# EAGLE schematic LEDBatterychargeIndicatorCircuit (EAGLE 9.4.2)
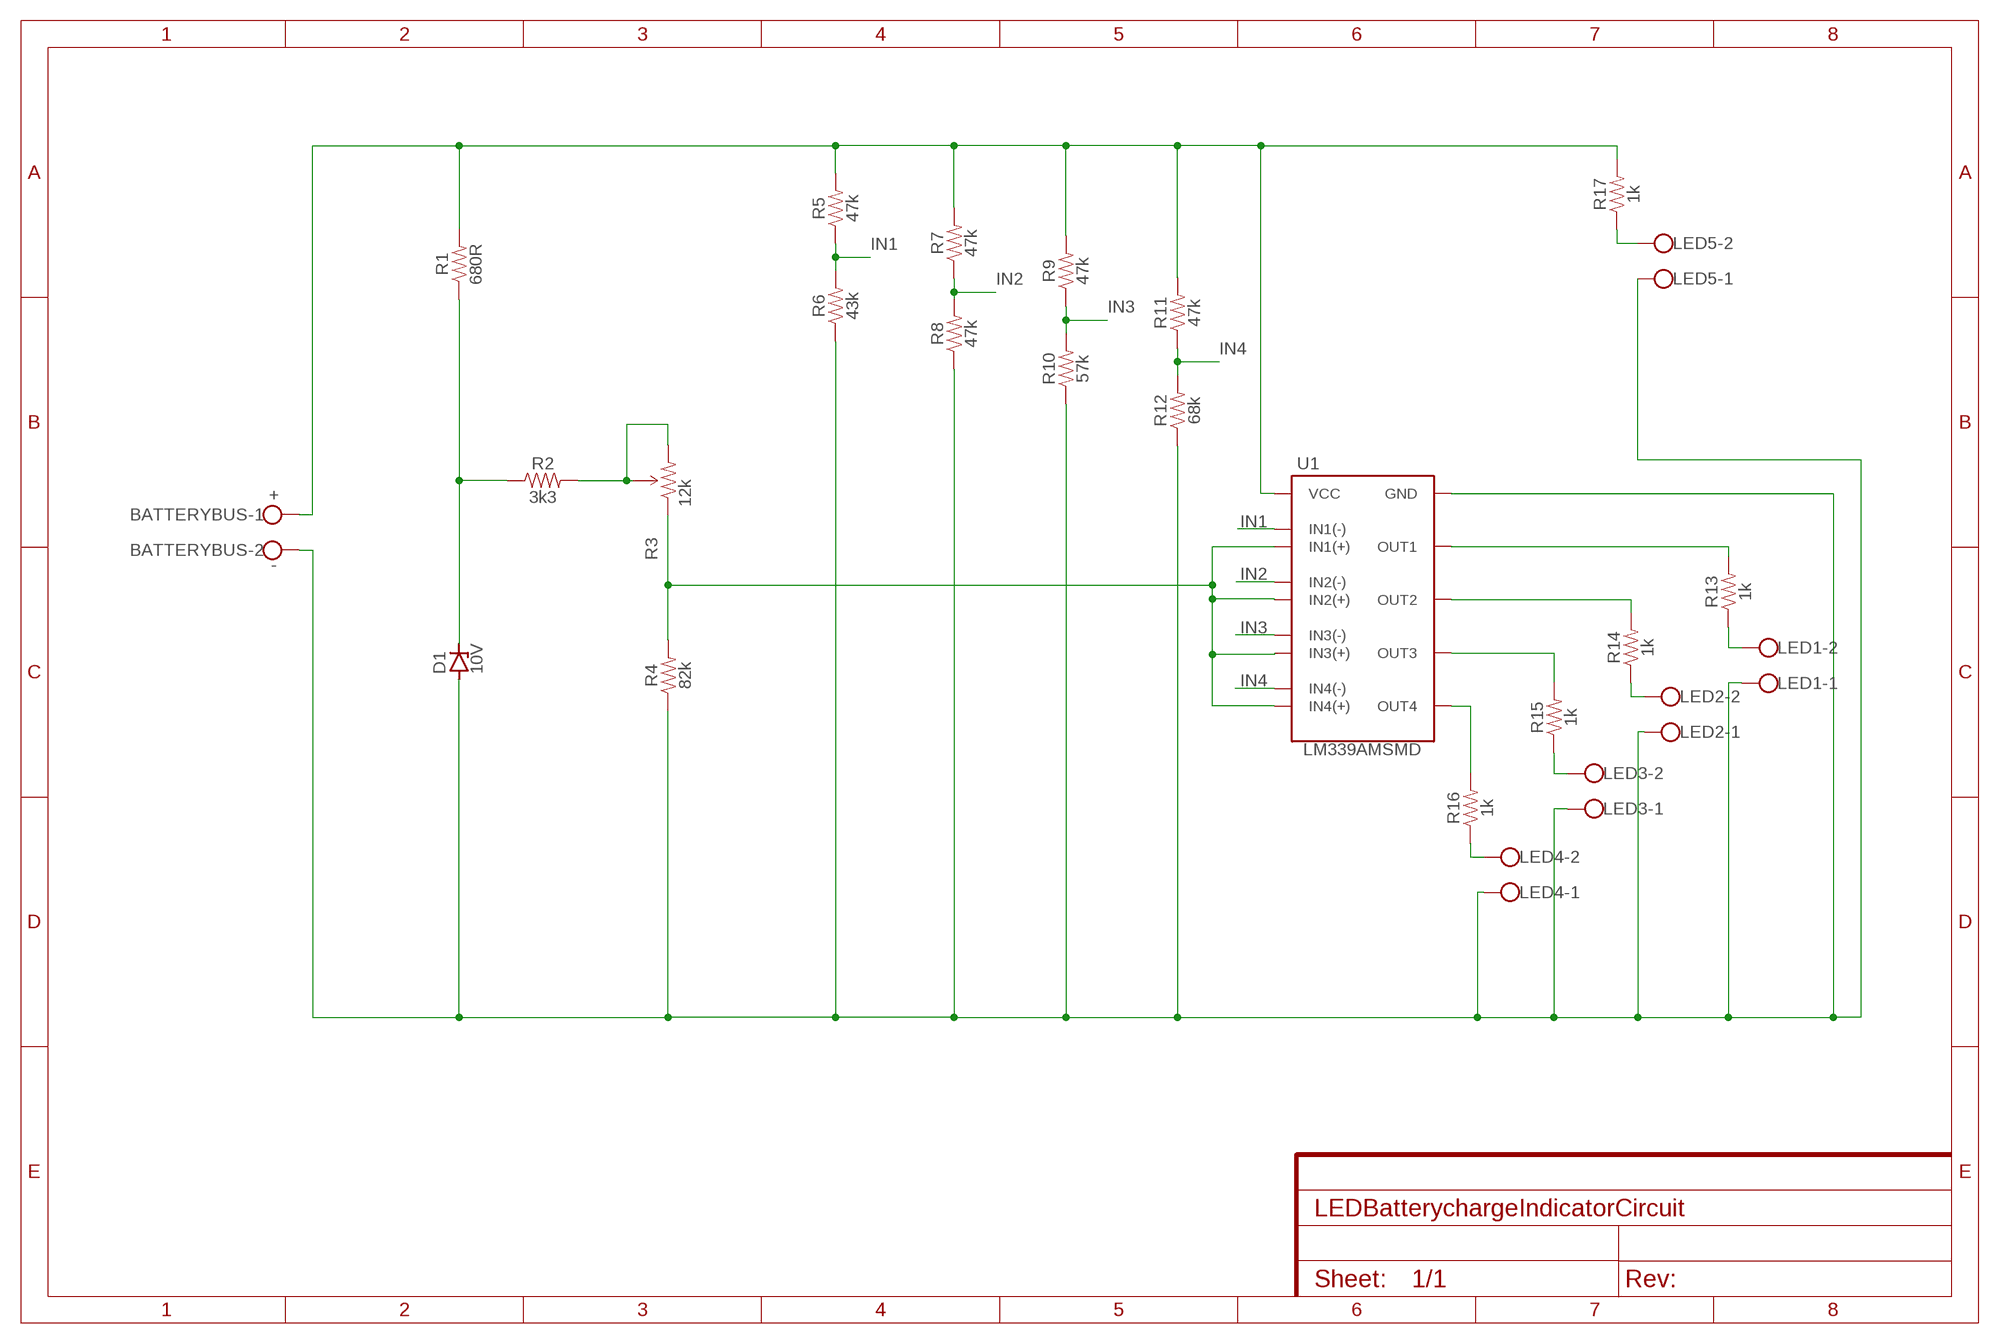
[diagram p0: schematic, sheet 1]

## Parts
BATTERYBUS  W237-102  [W237-102]
D1  10V  ZENER-DIODEF126-12  [F126Z12]
LED1  W237-102  [W237-102]
LED2  W237-102  [W237-102]
LED3  W237-102  [W237-102]
LED4  W237-102  [W237-102]
LED5  W237-102  [W237-102]
R1  680R  RESISTOR0805  [0805]
R2  3k3  RESISTOR0805  [0805]
R3  12k  TRIMPOTPTH  [TRIM_POT_PTH]
R4  82k  RESISTOR0805  [0805]
R5  47k  RESISTOR0805  [0805]
R6  43k  RESISTOR0805  [0805]
R7  47k  RESISTOR0805  [0805]
R8  47k  RESISTOR0805  [0805]
R9  47k  RESISTOR0805  [0805]
R10  57k  RESISTOR0805  [0805]
R11  47k  RESISTOR0805  [0805]
R12  68k  RESISTOR0805  [0805]
R13  1k  RESISTOR0805  [0805]
R14  1k  RESISTOR0805  [0805]
R15  1k  RESISTOR0805  [0805]
R16  1k  RESISTOR0805  [0805]
R17  1k  RESISTOR0805  [0805]
U1  LM339AMSMD  [LM339AM]

## Nets
IN1: R5.1 R6.2 U1.4(IN1(-))
IN2: R7.1 R8.2 U1.6(IN2(-))
IN3: R9.1 R10.2 U1.8(IN3(-))
IN4: R11.1 R12.2 U1.10(IN4(-))
N$1: BATTERYBUS.1
N$2: R1.2 R5.2 R7.2 R9.2 R11.2 R17.2 U1.3(VCC)
N$4: D1.C R1.1 R2.1
N$5: R13.2 U1.2(OUT1)
N$6: R2.2 R3.2(WIPER) R3.3(CW)
N$7: BATTERYBUS.2 D1.A LED1.1 LED2.1 LED3.1 LED4.1 LED5.1 R4.1 R6.1 R8.1 R10.1 R12.1 U1.12(GND)
N$8: LED1.2 R13.1
N$9: R14.2 U1.1(OUT2)
N$10: LED2.2 R14.1
N$11: R15.2 U1.14(OUT3)
N$12: R3.1(CCW) R4.2 U1.5(IN1(+)) U1.7(IN2(+)) U1.9(IN3(+)) U1.11(IN4(+))
N$13: LED3.2 R15.1
N$14: R16.2 U1.13(OUT4)
N$15: LED4.2 R16.1
N$16: LED5.2 R17.1

## Notes on the sheet
- +
- -

## Library data of the parts
BATTERYBUS LED1-LED5 = con-wago-500:W237-102: WAGO SCREW CLAMP; MPN: 237-102; OC_FARNELL: unknown; OC_NEWARK: 70K9898
D1 = diode:ZENER-DIODE: Z-Diode
R1 R2 R4-R17 = SparkFun-Resistors:RESISTOR: Generic Resistor Package
R3 = SparkFun-Retired:TRIMPOT: Various small potentiometers for "set-and-forget" applications; PROD_ID: RES-08445
U1 = RequiredComponents:LM339AM: The LM339AM is a quad comparator that requires 32V supply (+-18V) with a typical response time of 1.3us